# Altium schematic sheet DX-LR01-V1.1_SCH_Part_AD.SchDoc
size A4
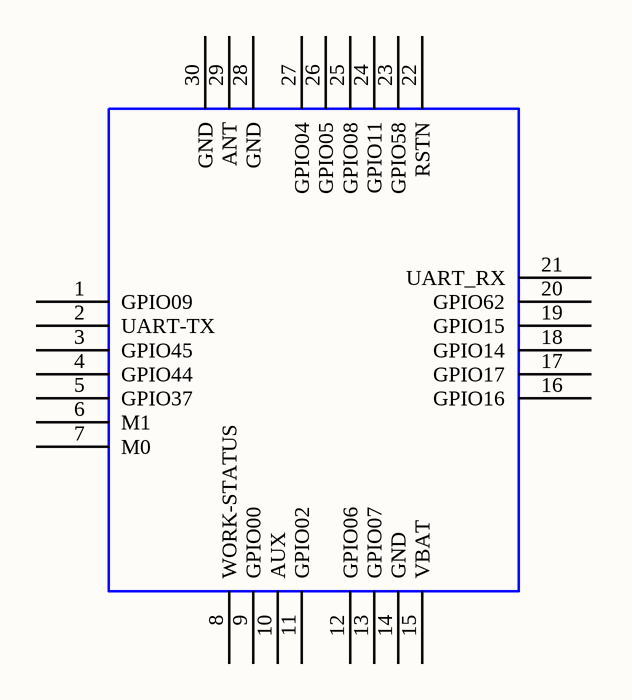
[diagram p0: DX-LR01-V1.1_SCH_Part_AD.SchDoc]

## Parts
?  (no value)

## Nets

Not connected (* = marked no-connect by the designer): ? 1(GPIO09) 2(UART-TX) 3(GPIO45) 4(GPIO44) 5(GPIO37) 6(M1) 7(M0) 8(WORK-STATUS) 9(GPIO00) 10(AUX) 11(GPIO02) 12(GPIO06) 13(GPIO07) 14(GND) 15(VBAT) 16(GPIO16) 17(GPIO17) 18(GPIO14) 19(GPIO15) 20(GPIO62) 21(UART_RX) 22(RSTN) 23(GPIO58) 24(GPIO11) 25(GPIO08) 26(GPIO05) 27(GPIO04) 28(GND) 29(ANT) 30(GND)

## Library data of the parts
? = Component_1